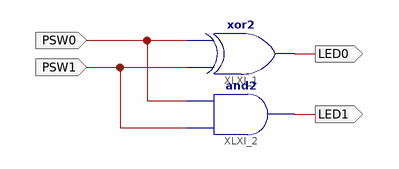
[diagram p0: schematic sheet 1]
// Xilinx ISE schematic lab5_3_HA.sch (spartan3) as structural Verilog: 2 symbols, 4 ports
module lab5_3_HA (
  input  PSW0,
  input  PSW1,
  output LED0,
  output LED1
);

  xor XLXI_1 (LED0, PSW1, PSW0);
  and XLXI_2 (LED1, PSW1, PSW0);
endmodule
